# EAGLE design M161XX (EAGLE 6.6.0)
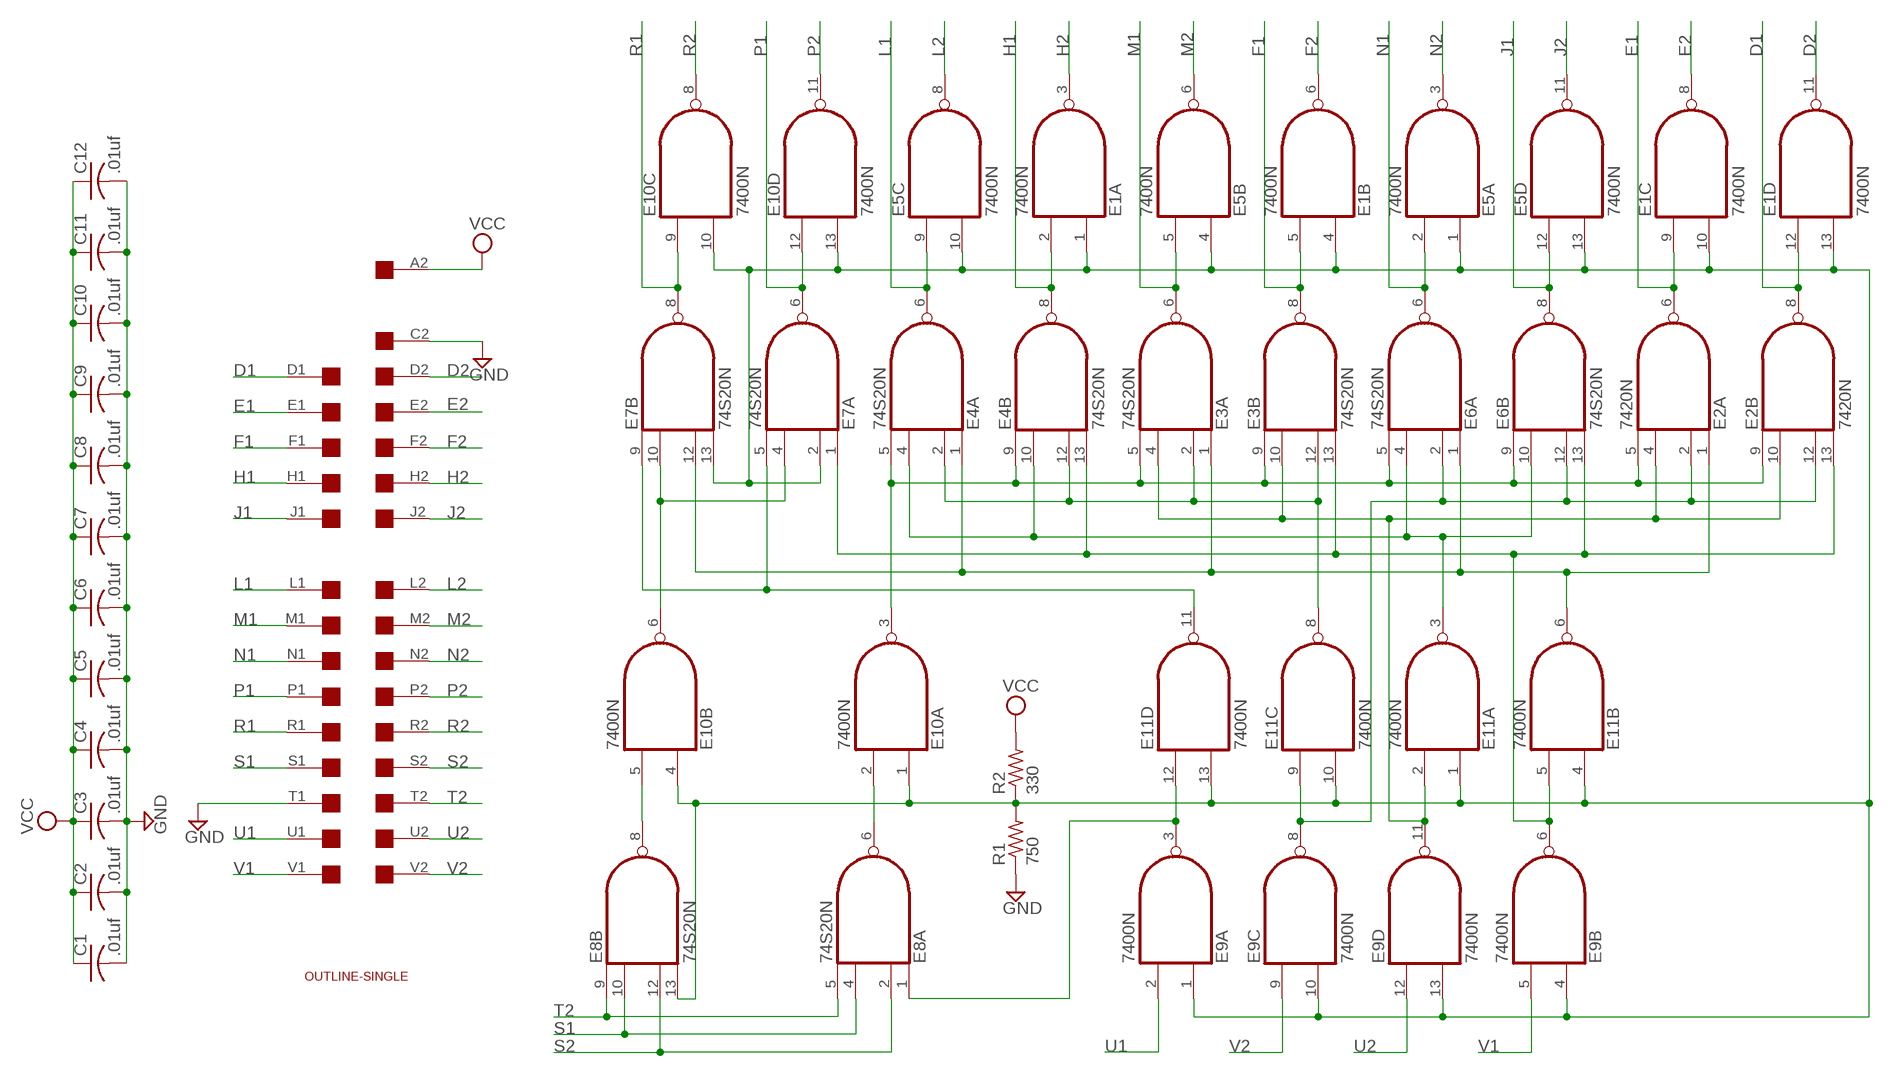
[diagram p0: schematic, sheet 1]

## Parts
C1  .01uf  C-US050-025X075  [C050-025X075]
C2  .01uf  C-US050-025X075  [C050-025X075]
C3  .01uf  C-US050-025X075  [C050-025X075]
C4  .01uf  C-US050-025X075  [C050-025X075]
C5  .01uf  C-US050-025X075  [C050-025X075]
C6  .01uf  C-US050-025X075  [C050-025X075]
C7  .01uf  C-US050-025X075  [C050-025X075]
C8  .01uf  C-US050-025X075  [C050-025X075]
C9  .01uf  C-US050-025X075  [C050-025X075]
C10  .01uf  C-US050-025X075  [C050-025X075]
C11  .01uf  C-US050-025X075  [C050-025X075]
C12  .01uf  C-US050-025X075  [C050-025X075]
E1  7400N  [DIL14]
E2  7420N  74S20N  [DIL14]
E3  74S20N  [DIL14]
E4  74S20N  [DIL14]
E5  7400N  [DIL14]
E6  74S20N  [DIL14]
E7  74S20N  [DIL14]
E8  74S20N  [DIL14]
E9  7400N  [DIL14]
E10  7400N  [DIL14]
E11  7400N  [DIL14]
R1  750  R-US_0207/10  [0207/10]
R2  330  R-US_0207/10  [0207/10]
U$1  OUTLINE-SINGLE  [SINGLE]
U$4  SINGLE  [EDGE-CON2]

## Nets
D1: E1.12(D:I0) E2.8(B:O) U$4.D1
D2: E1.11(D:O) U$4.D2
E1: E1.9(C:I0) E2.6(A:O) U$4.E1
E2: E1.8(C:O) U$4.E2
F1: E1.5(B:I1) E3.8(B:O) U$4.F1
F2: E1.6(B:O) U$4.F2
GND [power]: C1.2 C2.2 C3.2 C4.2 C5.2 C6.2 C7.2 C8.2 C9.2 C10.2 C11.2 C12.2 R1.1 U$4.C2 U$4.T1
H1: E1.2(A:I1) E4.8(B:O) U$4.H1
H2: E1.3(A:O) U$4.H2
J1: E5.12(D:I0) E6.8(B:O) U$4.J1
J2: E5.11(D:O) U$4.J2
L1: E4.6(A:O) E5.9(C:I0) U$4.L1
L2: E5.8(C:O) U$4.L2
M1: E3.6(A:O) E5.5(B:I1) U$4.M1
M2: E5.6(B:O) U$4.M2
N1: E5.2(A:I1) E6.6(A:O) U$4.N1
N2: E5.3(A:O) U$4.N2
N$1: E1.1(A:I0) E1.4(B:I0) E1.10(C:I1) E1.13(D:I1) E5.1(A:I0) E5.4(B:I0) E5.10(C:I1) E5.13(D:I1) E7.2(A:I1) E7.13(B:I3) E8.13(B:I3) E9.1(A:I0) E9.4(B:I0) E9.10(C:I1) E9.13(D:I1) E10.1(A:I0) E10.4(B:I0) E10.10(C:I1) E10.13(D:I1) E11.1(A:I0) E11.4(B:I0) E11.10(C:I1) E11.13(D:I1) R1.2 R2.1
N$2: E8.8(B:O) E10.5(B:I1)
N$4: E7.4(A:I2) E7.10(B:I1) E10.6(B:O)
N$5: E2.5(A:I3) E2.9(B:I0) E3.5(A:I3) E3.9(B:I0) E4.5(A:I3) E4.9(B:I0) E6.5(A:I3) E6.9(B:I0) E10.3(A:O)
N$6: E8.6(A:O) E10.2(A:I1)
N$7: E8.1(A:I0) E9.3(A:O) E11.12(D:I0)
N$8: E2.2(A:I1) E2.12(B:I2) E6.2(A:I1) E6.12(B:I2) E9.8(C:O) E11.9(C:I0)
N$9: E2.4(A:I2) E2.10(B:I1) E3.4(A:I2) E3.10(B:I1) E9.11(D:O) E11.2(A:I1)
N$10: E2.13(B:I3) E3.13(B:I3) E4.13(B:I3) E6.13(B:I3) E7.1(A:I0) E9.6(B:O) E11.5(B:I1)
N$11: E3.2(A:I1) E3.12(B:I2) E4.2(A:I1) E4.12(B:I2) E11.8(C:O)
N$12: E7.5(A:I3) E7.9(B:I0) E11.11(D:O)
N$24: E4.4(A:I2) E4.10(B:I1) E6.4(A:I2) E6.10(B:I1) E11.3(A:O)
N$25: E2.1(A:I0) E3.1(A:I0) E4.1(A:I0) E6.1(A:I0) E7.12(B:I2) E11.6(B:O)
P1: E7.6(A:O) E10.12(D:I0) U$4.P1
P2: E10.11(D:O) U$4.P2
R1: E7.8(B:O) E10.9(C:I0) U$4.R1
R2: E10.8(C:O) U$4.R2
S1: E8.4(A:I2) E8.10(B:I1) U$4.S1
S2: E8.2(A:I1) E8.12(B:I2) U$4.S2
T2: E8.5(A:I3) E8.9(B:I0) U$4.T2
U1: E9.2(A:I1) U$4.U1
U2: E9.12(D:I0) U$4.U2
V1: E9.5(B:I1) U$4.V1
V2: E9.9(C:I0) U$4.V2
VCC [power]: C1.1 C2.1 C3.1 C4.1 C5.1 C6.1 C7.1 C8.1 C9.1 C10.1 C11.1 C12.1 R2.2 U$4.A2
Unconnected: U$4.A1 U$4.B1 U$4.B2 U$4.C1 U$4.K1 U$4.K2

## Power pins joined to a net without a drawn wire
GND: E1.7(P:GND) E2.7(P:GND) E3.7(P:GND) E4.7(P:GND) E5.7(P:GND) E6.7(P:GND) E7.7(P:GND) E8.7(P:GND) E9.7(P:GND) E10.7(P:GND) E11.7(P:GND)
VCC: E1.14(P:VCC) E2.14(P:VCC) E3.14(P:VCC) E4.14(P:VCC) E5.14(P:VCC) E6.14(P:VCC) E7.14(P:VCC) E8.14(P:VCC) E9.14(P:VCC) E10.14(P:VCC) E11.14(P:VCC)

## Library data of the parts
C1-C12 = rcl:C-US: CAPACITOR, American symbol
E1 E5 E9-E11 = 74xx-us:74*00: Quad 2-input NAND gate
E2-E4 E6-E8 = 74xx-us:74*20: Dual 4-input NAND gate
R1 R2 = rcl:R-US_: RESISTOR, American symbol
U$1 = dec-con:OUTLINE-*: Board outlines for DEC boards.
U$4 = dec-con:SINGLE: Single-Height DEC board

## Net classes
0 default: width 0.381 mm
1 power: width 0.762 mm

## Board
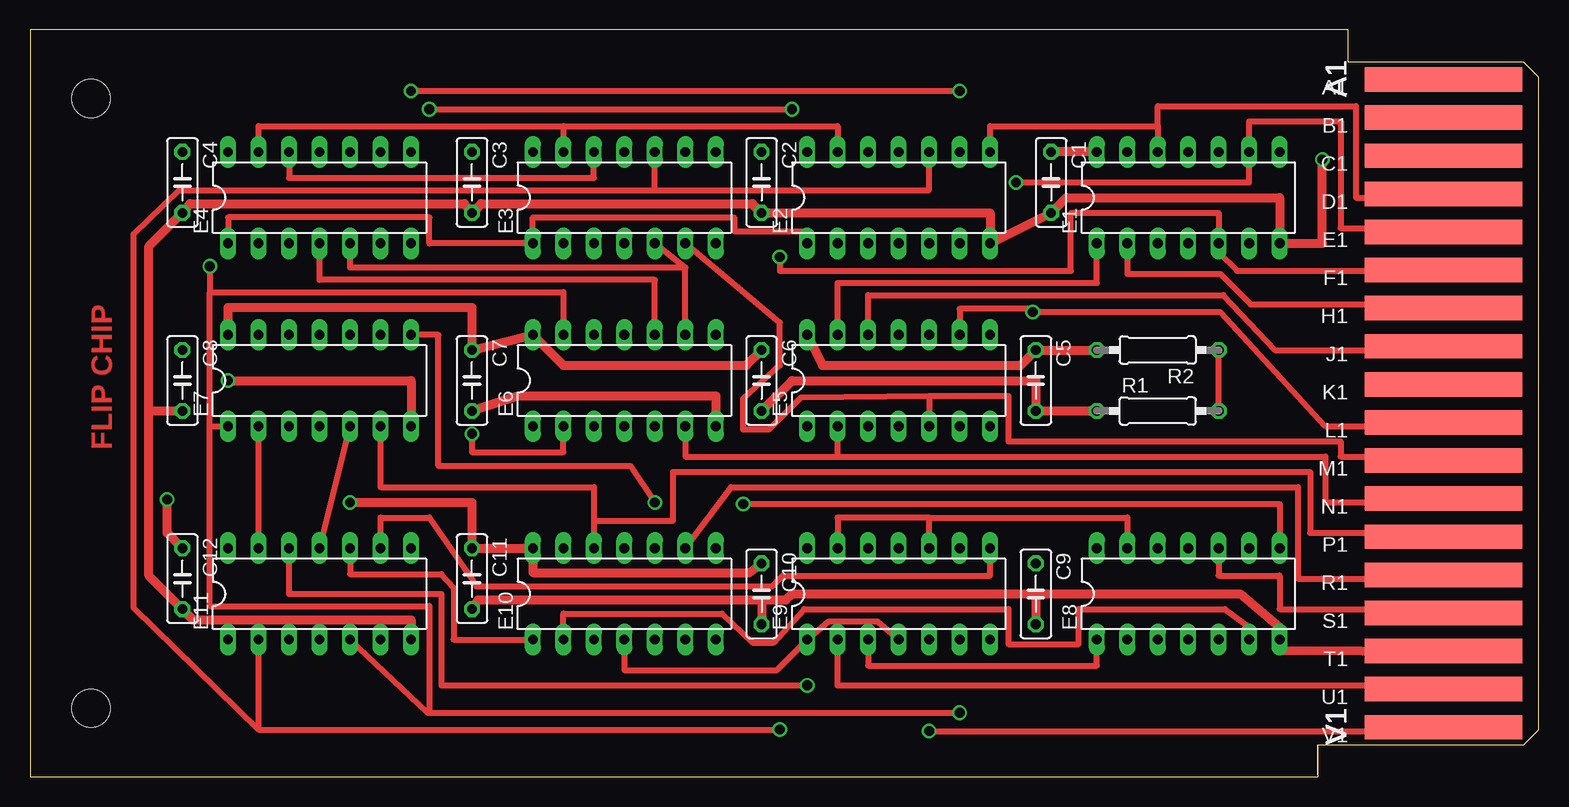
[diagram p1: board, top side]
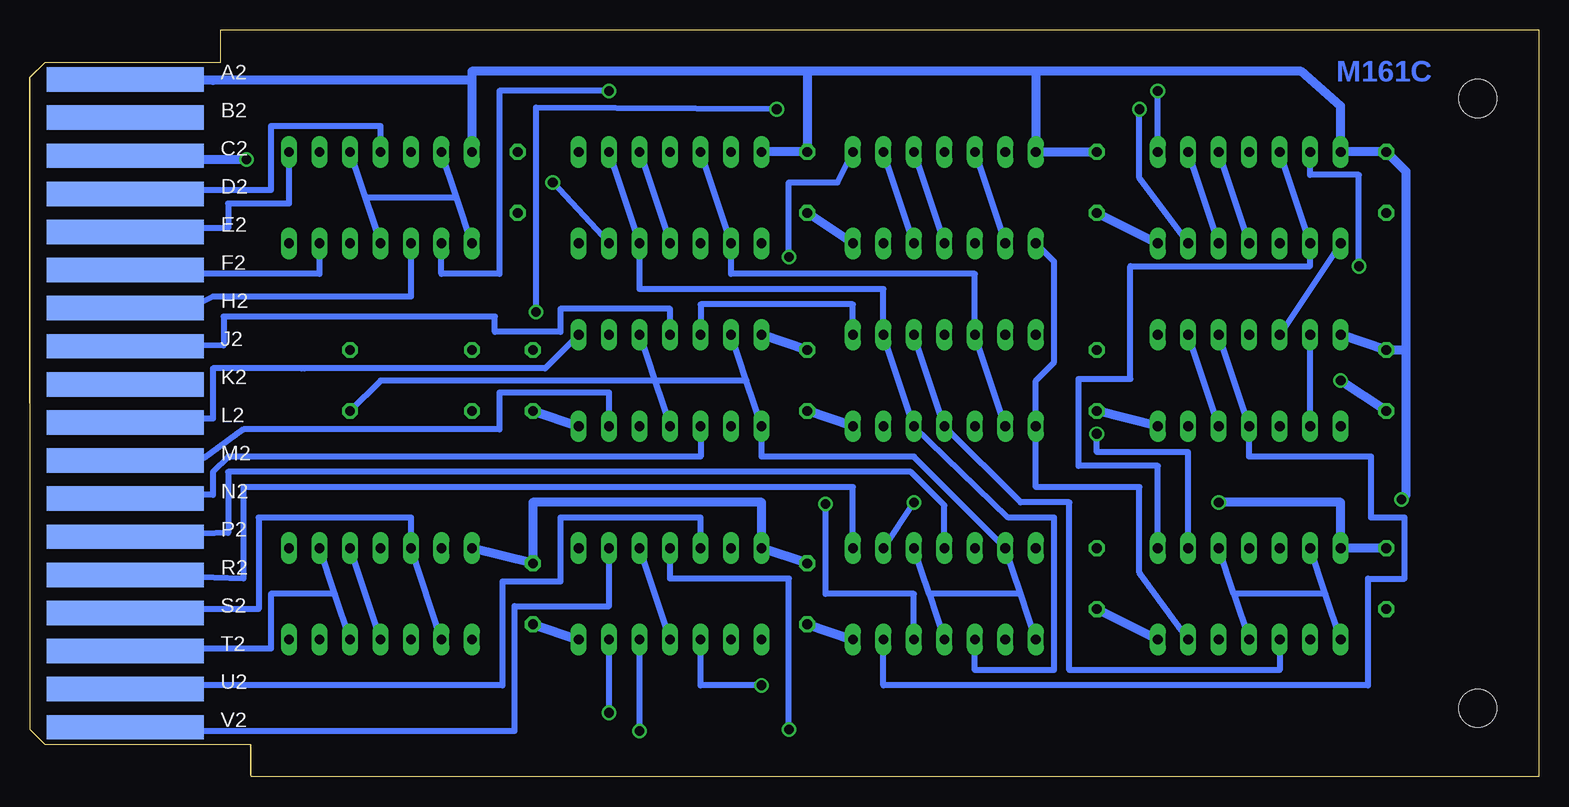
[diagram p2: board, bottom side, seen from below]

Size 125.73 x 62.23 mm. Coordinates in mm from the lower left corner, seen from the top.
Copper layers (1+16): Top 0.035mm / dielectric 1.5mm / Bottom 0.035mm
Design rules "16mils": minimum track width 16mil, minimum drill 32mil, track to track 15mil, track to pad 10mil, pad to pad 10mil, via to via 10mil, smd to smd 10mil, copper to edge 13mil, drill to drill 10mil, minimum pad ring 10mil, minimum via ring 8mil, stop-mask expansion 0mil, vias tented up to drill 0mil, thermal gap 10mil

### Footprints (pad centres in the part's own frame; a part is rotated, then mirrored left to right if it is on the bottom)
C050-025X075 = drill 0.813 octagon: 1 -2.54,0; 2 2.54,0
DIL14 = drill 0.813 long: 1 -7.62,-3.81; 2 -5.08,-3.81; 3 -2.54,-3.81; 4 0,-3.81; 5 2.54,-3.81; 6 5.08,-3.81; 7 7.62,-3.81; 8 7.62,3.81; 9 5.08,3.81; 10 2.54,3.81; 11 0,3.81; 12 -2.54,3.81; 13 -5.08,3.81; 14 -7.62,3.81
0207/10 = drill 0.813 octagon: 1 -5.08,0; 2 5.08,0
SINGLE = hole 3.175: 120.65,56.515; 120.65,5.715
EDGE-CON2 = smd 13.106 x 2.032: A1 7.938,4.128; B1 7.938,7.303; C1 7.938,10.477; D1 7.938,13.652; E1 7.938,16.828; F1 7.938,20.003; H1 7.938,23.177; J1 7.938,26.352; K1 7.938,29.527; L1 7.938,32.703; M1 7.938,35.877; N1 7.938,39.053; P1 7.938,42.227; R1 7.938,45.403; S1 7.938,48.578; T1 7.938,51.752; U1 7.938,54.928; V1 7.938,58.102 | smd 13.106 x 2.032 bottom: A2 7.938,4.128; B2 7.938,7.303; C2 7.938,10.477; D2 7.938,13.652; E2 7.938,16.828; F2 7.938,20.003; H2 7.938,23.177; J2 7.938,26.352; K2 7.938,29.527; L2 7.938,32.703; M2 7.938,35.877; N2 7.938,39.053; P2 7.938,42.227; R2 7.938,45.403; S2 7.938,48.578; T2 7.938,51.752; U2 7.938,54.928; V2 7.938,58.102

### Placement (x,y rotation side)
C1  85.09,49.53 270 top
C2  60.96,49.53 270 top
C3  36.83,49.53 270 top
C4  12.7,49.53 270 top
C5  83.82,33.02 270 top
C6  60.96,33.02 270 top
C7  36.83,33.02 270 top
C8  12.7,33.02 270 top
C9  83.82,15.24 270 top
C10  60.96,15.24 270 top
C11  36.83,16.51 270 top
C12  12.7,16.51 270 top
E1  96.52,48.26 0 top
E2  72.39,48.26 0 top
E3  49.53,48.26 0 top
E4  24.13,48.26 0 top
E5  72.39,33.02 0 top
E6  49.53,33.02 0 top
E7  24.13,33.02 0 top
E8  96.52,15.24 0 top
E9  72.39,15.24 0 top
E10  49.53,15.24 0 top
E11  24.13,15.24 0 top
R1  93.98,30.48 0 top
R2  93.98,35.56 180 top
U$1  125.73,62.23 180 top
U$4  125.73,62.23 180 top

### Tracks (layer width: path | path; a pad name or v marks a point on that pad's centre or on a via)
D1
  Top 0.508: 93.98,54.23 80.01,54.23 E2.8 | 93.98,54.23 E1.12 | 93.98,54.23 93.98,55.88 110.49,55.88 110.49,48.26 118.11,48.26 U$4.D1
D2
  Bottom 0.508: E1.11 96.52,54.23 105.66,54.23 105.66,48.9 111.76,48.9 U$4.D2
E1  (via drill 0.81)
  Top 0.508: U$4.E1 118.11,45.72 109.22,45.72 109.22,54.61 101.6,54.61 E1.9 101.6,49.53 v82.17,49.53
  Bottom 0.508: E2.6 v82.17,49.53
E2
  Bottom 0.508: E1.8 104.14,47.75 109.22,47.75 109.22,45.72 118.11,45.72 U$4.E2
F1  (via drill 0.81)
  Top 0.508: U$4.F1 118.11,42.16 100.58,42.16 99.06,43.69 E1.5 99.06,46.99 86.74,46.99 86.74,42.16 62.48,42.16 v62.48,43.31
  Bottom 0.508: v62.48,43.31 62.48,49.53 58.42,49.53 E3.8
F2
  Bottom 0.508: E1.6 101.6,41.91 118.11,41.91 U$4.F2
GND  (via drill 0.81)
  Top 0.762: U$4.T1 104.14,10.54 E8.7 104.14,12.45 100.84,15.24 83.82,15.24 | v107.7,51.44 107.7,44.45 E1.7 104.14,48.26 86.36,48.26 C1.2 E2.7 80.01,46.99 C2.2 60.2,47.75 37.59,47.75 C3.2 36.2,47.75 13.34,47.75 C4.2 9.91,44.2 9.91,30.48 | 9.91,30.48 9.91,16.76 C12.2 13.59,13.08 31.75,13.08 E11.7 | 9.91,30.48 C8.2 | R1.1 C5.2 83.82,33.02 63.5,33.02 C6.2 | C11.2 37.34,14.73 60.96,14.73 | 60.96,14.73 C10.2 | 83.82,15.24 C9.2 | 60.96,14.73 62.99,14.73 63.5,15.24 83.82,15.24 | C7.2 40.64,31.75 57.15,31.75 E6.7 | v16.51,33.02 31.75,33.02 E7.7
  Bottom 0.762: v107.7,51.44 111.76,51.44 U$4.C2 | C2.2 E3.7 | E7.7 C7.2 | E6.7 C6.2 | C5.2 E5.7 | E11.7 C11.2 | C10.2 E10.7 | C9.2 E9.7 | C3.2 E4.7 | C8.2 v16.51,33.02
H1  (via drill 0.81)
  Top 0.508: E1.2 91.44,41.91 99.19,41.91 101.73,39.37 118.11,39.37 U$4.H1 | v31.75,57.15 v77.47,57.15
  Bottom 0.508: E4.8 v31.75,57.15 | v77.47,57.15 86.61,57.15 86.61,41.91 91.44,41.91 E1.2
H2
  Bottom 0.508: E1.3 93.98,40.01 110.49,40.01 111.76,39.37 U$4.H2
J1
  Top 0.508: E5.12 69.85,40.13 99.44,40.13 103.76,35.56 118.11,35.56 U$4.J1
  Bottom 0.508: E6.8 57.15,39.37 69.85,39.37 E5.12
J2
  Bottom 0.508: E5.11 72.39,38.99 81.53,38.99 81.53,37.08 87,37.08 87,38.35 109.6,38.35 109.6,35.94 U$4.J2
L1  (via drill 0.81)
  Top 0.508: E5.9 77.47,38.99 83.19,38.99 v83.57,38.73 99.19,38.73 107.95,29.21 118.11,29.21 U$4.L1 | v33.27,55.63 v63.5,55.63
  Bottom 0.508: E4.6 33.27,49.91 v33.27,55.63 | v63.5,55.63 83.57,55.75 v83.57,38.73
L2
  Bottom 0.508: E5.8 82.8,34.04 102.87,34.04 | 102.87,34.04 103.12,34.04 | 118.11,29.21 U$4.L2 111.76,29.84 110.49,29.84 110.49,34.04 102.87,34.04
M1
  Top 0.508: 74.93,31.75 E5.5 | U$4.M1 118.11,26.67 109.22,26.67 109.22,27.94 81.53,27.94 81.53,31.75 74.93,31.75 | E3.6 62.48,37.85 62.48,34.29 59.44,31.5 59.44,28.96 61.59,28.96 64.26,31.62 74.93,31.75
M2
  Bottom 0.508: U$4.M2 111.25,26.54 107.95,28.96 86.61,28.96 86.61,32 77.47,32 E5.6
N1
  Top 0.508: 67.31,26.67 107.95,26.67 107.95,22.86 118.11,22.86 U$4.N1 | 67.31,26.67 E5.2 | 67.31,26.67 54.61,26.67 E6.6
N2
  Bottom 0.508: E5.3 69.85,26.67 109.22,26.67 110.49,25.4 110.49,23.5 111.76,23.5 U$4.N2
N$1
  Top 0.508: R1.2 R2.1 | E11.13 E7.2 | E9.10 74.93,21.59 | 74.93,21.59 91.44,21.59 E8.13 | E9.13 67.31,21.59 74.93,21.59 | E5.13 67.31,41.15 88.9,41.15 E1.1 | E11.10 26.67,16.89 34.29,16.89 35.31,15.75 35.31,11.43 E10.1 | E10.4 49.53,8.89 62.23,8.89 E9.1 66.55,12.95 70.61,12.95 E9.4
  Bottom 0.508: E7.2 E7.13 | 90.17,48.26 E1.13 | E1.1 90.17,48.26 | E1.10 E1.4 97.79,48.26 90.17,48.26 | 66.04,33.02 E5.13 | 66.04,33.02 E5.1 64.77,26.67 52.07,26.67 E10.13 43.18,15.24 | 73.66,33.02 E5.4 | 66.04,33.02 73.66,33.02 | R1.2 96.52,33.02 73.66,33.02 | E5.10 73.66,33.02 | 17.78,15.24 E11.13 | E11.1 17.78,15.24 | 25.4,15.24 E11.4 | 17.78,15.24 25.4,15.24 | 25.4,15.24 E11.10 | E10.1 43.18,15.24 | 50.8,15.24 E10.4 | 43.18,15.24 50.8,15.24 | 50.8,15.24 E10.10 | E9.4 E9.10
N$2  (via drill 0.81)
  Top 0.508: E8.8 104.14,22.73 v59.44,22.73
  Bottom 0.508: v59.44,22.73 59.44,15.24 52.07,15.24 E10.5
N$4
  Bottom 0.508: E7.10 E7.4 24.13,26.67 13.97,26.67 13.97,21.59 11.18,21.59 11.18,16.51 14.22,16.51 14.22,7.62 54.61,7.62 E10.6
N$5
  Top 0.508: 54.61,42.42 26.67,42.42 E4.5 | E6.9 54.61,42.42 | 54.61,42.42 E3.5
  Bottom 0.508: E2.9 E2.5 74.93,40.64 54.61,40.64 E6.9 E6.5 44.2,21.59 40.39,21.59 40.39,8.89 46.99,8.89 E10.3 | E3.5 E3.9 | E4.5 E4.9
N$6
  Top 0.508: E10.2 44.45,13.59 57.66,13.59 60.2,11.18 61.98,11.18 64.52,13.97 81.53,13.97 81.53,11.05 87.38,11.05 87.38,13.97 99.57,13.97 101.6,12.45 E8.6
N$7  (via drill 0.81)
  Top 0.508: E8.1 88.9,9.27 69.85,9.27 E9.3 | E11.12 21.59,15.24 34.29,15.24 34.29,7.62 v64.77,7.62
  Bottom 0.508: v64.77,7.62 69.85,7.62 E9.3
N$8  (via drill 0.81)
  Top 0.508: v36.83,28.57 36.83,27.05 44.45,27.05 E6.2 | E9.8 80.01,16.76 62.74,16.76 61.85,15.88 37.21,15.88 33.27,21.59 29.21,21.59 E11.9
  Bottom 0.508: v36.83,28.57 36.83,27.05 29.21,27.05 E11.9 | E2.12 E2.2 67.31,41.91 46.99,41.91 E6.12 E6.2
N$9  (via drill 0.81)
  Top 0.508: 19.05,3.94 8.64,14.1 8.64,45.21 12.45,48.9 52.07,48.9 | 52.07,48.9 E3.10 | 52.07,48.9 74.93,48.9 E2.10 | 19.05,3.94 v62.48,3.94 | 19.05,3.94 E11.2
  Bottom 0.508: E2.10 E2.4 | E3.10 E3.4 | v62.48,3.94 62.48,16.51 72.39,16.51 E9.11
N$10  (via drill 0.81)
  Top 0.508: 44.45,54.23 E3.13 | E4.13 19.05,54.23 44.45,54.23 | 44.45,54.23 67.31,54.23 E2.13 | 14.99,29.21 14.99,40.39 | v14.99,42.55 14.99,41.91 14.99,40.39 | 33.27,5.33 33.15,5.33 E11.5 | 33.27,5.33 v77.47,5.33 | 14.99,29.21 E7.1 | 14.99,29.21 14.99,14.22 33.27,14.22 33.27,5.33 | E6.13 44.45,40.39 14.99,40.39
  Bottom 0.508: v14.99,42.55 14.99,50.16 19.05,50.16 E4.13 | v77.47,5.33 E9.6
N$11
  Top 0.508: E4.12 21.59,49.91 46.99,49.91 E3.12
  Bottom 0.508: E3.12 E3.2 | E4.12 E4.2 19.05,42.55 34.04,42.55 34.04,33.15 38.35,33.15 38.35,25.91 31.75,25.91 E11.8
N$12
  Top 0.508: E11.11 E7.5
  Bottom 0.508: E7.5 E7.9
N$24
  Top 0.508: E4.4 24.13,41.4 52.07,41.4 E6.10
  Bottom 0.508: E4.4 E4.10 | E6.10 E6.4 43.18,22.86 39.12,22.86 39.12,8.89 21.59,8.89 E11.3
N$25
  Top 0.508: E4.1 16.51,46.61 33.27,46.61 33.27,44.45 E3.1 41.91,46.61 58.67,46.61 58.67,45.47 64.77,45.47 E2.1
  Bottom 0.508: E3.1 40.39,42.93 40.39,34.54 41.91,33.02 E6.1 41.91,24.13 33.27,24.13 33.27,17.02 E11.6 | E4.1 E7.12
P1
  Top 0.508: E7.6 29.21,24.13 46.99,24.13 46.99,21.34 | 46.99,21.34 E10.12 | 46.99,21.34 53.59,21.34 53.59,25.4 106.68,25.4 106.68,20.32 118.11,20.32 U$4.P1
P2
  Bottom 0.508: U$4.P2 109.22,20.32 109.22,25.4 52.32,25.4 49.53,22.61 E10.11
R1  (via drill 0.81)
  Top 0.508: E10.9 58.42,24.13 105.66,24.13 105.66,16.51 118.11,16.51 U$4.R1 | v52.07,22.86 50.04,25.91 34.04,25.91 34.04,36.83 E7.8
  Bottom 0.508: v52.07,22.86 E10.9
R2
  Bottom 0.508: U$4.R2 107.95,16.51 107.95,24.13 57.15,24.13 E10.8
S1
  Top 0.508: U$4.S1 111.76,13.97 104.14,13.97 104.14,16.76 99.06,16.76 E8.10
  Bottom 0.508: E8.4 E8.10
S2
  Bottom 0.508: E8.2 E8.12 93.98,21.59 106.68,21.59 106.68,13.97 118.11,13.97 U$4.S2
T2
  Bottom 0.508: 100.33,15.24 E8.9 | E8.5 100.33,15.24 | U$4.T2 118.03,10.49 117.86,10.67 105.66,10.67 105.66,15.24 100.33,15.24
U1
  Top 0.508: E9.2 67.31,7.62 118.11,7.62 U$4.U1
U2
  Bottom 0.508: E9.12 69.85,21.59 81.53,21.59 81.53,16.26 86.36,16.26 86.36,7.62 118.11,7.62 U$4.U2
V1  (via drill 0.81)
  Top 0.508: v74.93,3.81 111.76,3.81 U$4.V1
  Bottom 0.508: v74.93,3.81 E9.5
V2
  Bottom 0.508: E9.9 77.47,14.22 85.34,14.22 85.34,3.81 118.11,3.81 U$4.V2
VCC  (via drill 0.81)
  Top 0.762: R2.2 C5.1 82.55,34.29 66.04,34.29 E5.14 | E1.14 C1.1 | v11.43,23.11 11.43,20.32 C12.1 | E7.14 16.51,39.12 36.83,39.12 C7.1 E6.14 44.45,34.29 59.69,34.29 C6.1 | v26.67,22.86 36.83,22.86 C11.1 E10.14 41.91,17.02 59.94,17.02 C10.1
  Bottom 0.762: 41.91,58.78 19.81,58.78 16.51,55.88 E4.14 C4.1 11.05,50.42 11.05,35.56 | 41.91,58.78 60.96,58.78 | 60.96,58.78 88.9,58.78 | 88.9,58.78 88.9,58.04 110.49,58.04 118.12,58.03 U$4.A2 | 41.91,58.78 E3.14 C3.1 | C2.1 E2.14 | C2.1 E2.14 | C2.1 E2.14 | 60.96,58.78 C2.1 | 88.9,58.78 E1.14 | E7.14 C8.1 11.05,35.56 | v11.43,23.11 11.05,23.5 11.05,35.56 | C12.1 E11.14 16.51,22.86 v26.67,22.86 | C10.1 E9.14 64.77,22.86 83.82,22.86 C9.1 E8.14 | C6.1 E5.14

### Text on the board
Top: FLIP CHIP
Bottom: M161C
tNames: A1 | A1 | A1 | A1 | A1 | A1 | A1 | A1 | A1 | A1 | A1 | A1 | A1 | A1 | A1 | A1 | A1 | A1 | A1 | A1 | A1 | A1 | A1 | A1 | A1 | A1 | A1 | A1 | A1 | A1 | A1 | A1 | V1 | V1 | V1 | V1 | V1 | V1 | V1 | V1 | V1 | V1 | V1 | V1 | V1 | V1 | V1 | V1 | V1 | V1 | V1 | V1 | V1 | V1 | V1 | V1 | V1 | V1 | V1 | V1 | V1 | V1 | V1 | V1